# Altium project RK_MEGAPLATA.PrjPcb (part 5 of 9)

## Sheet PORT_TYPE_C.SchDoc
size 420 x 297 mm; SheetNumber: 15; SheetTotal: 23
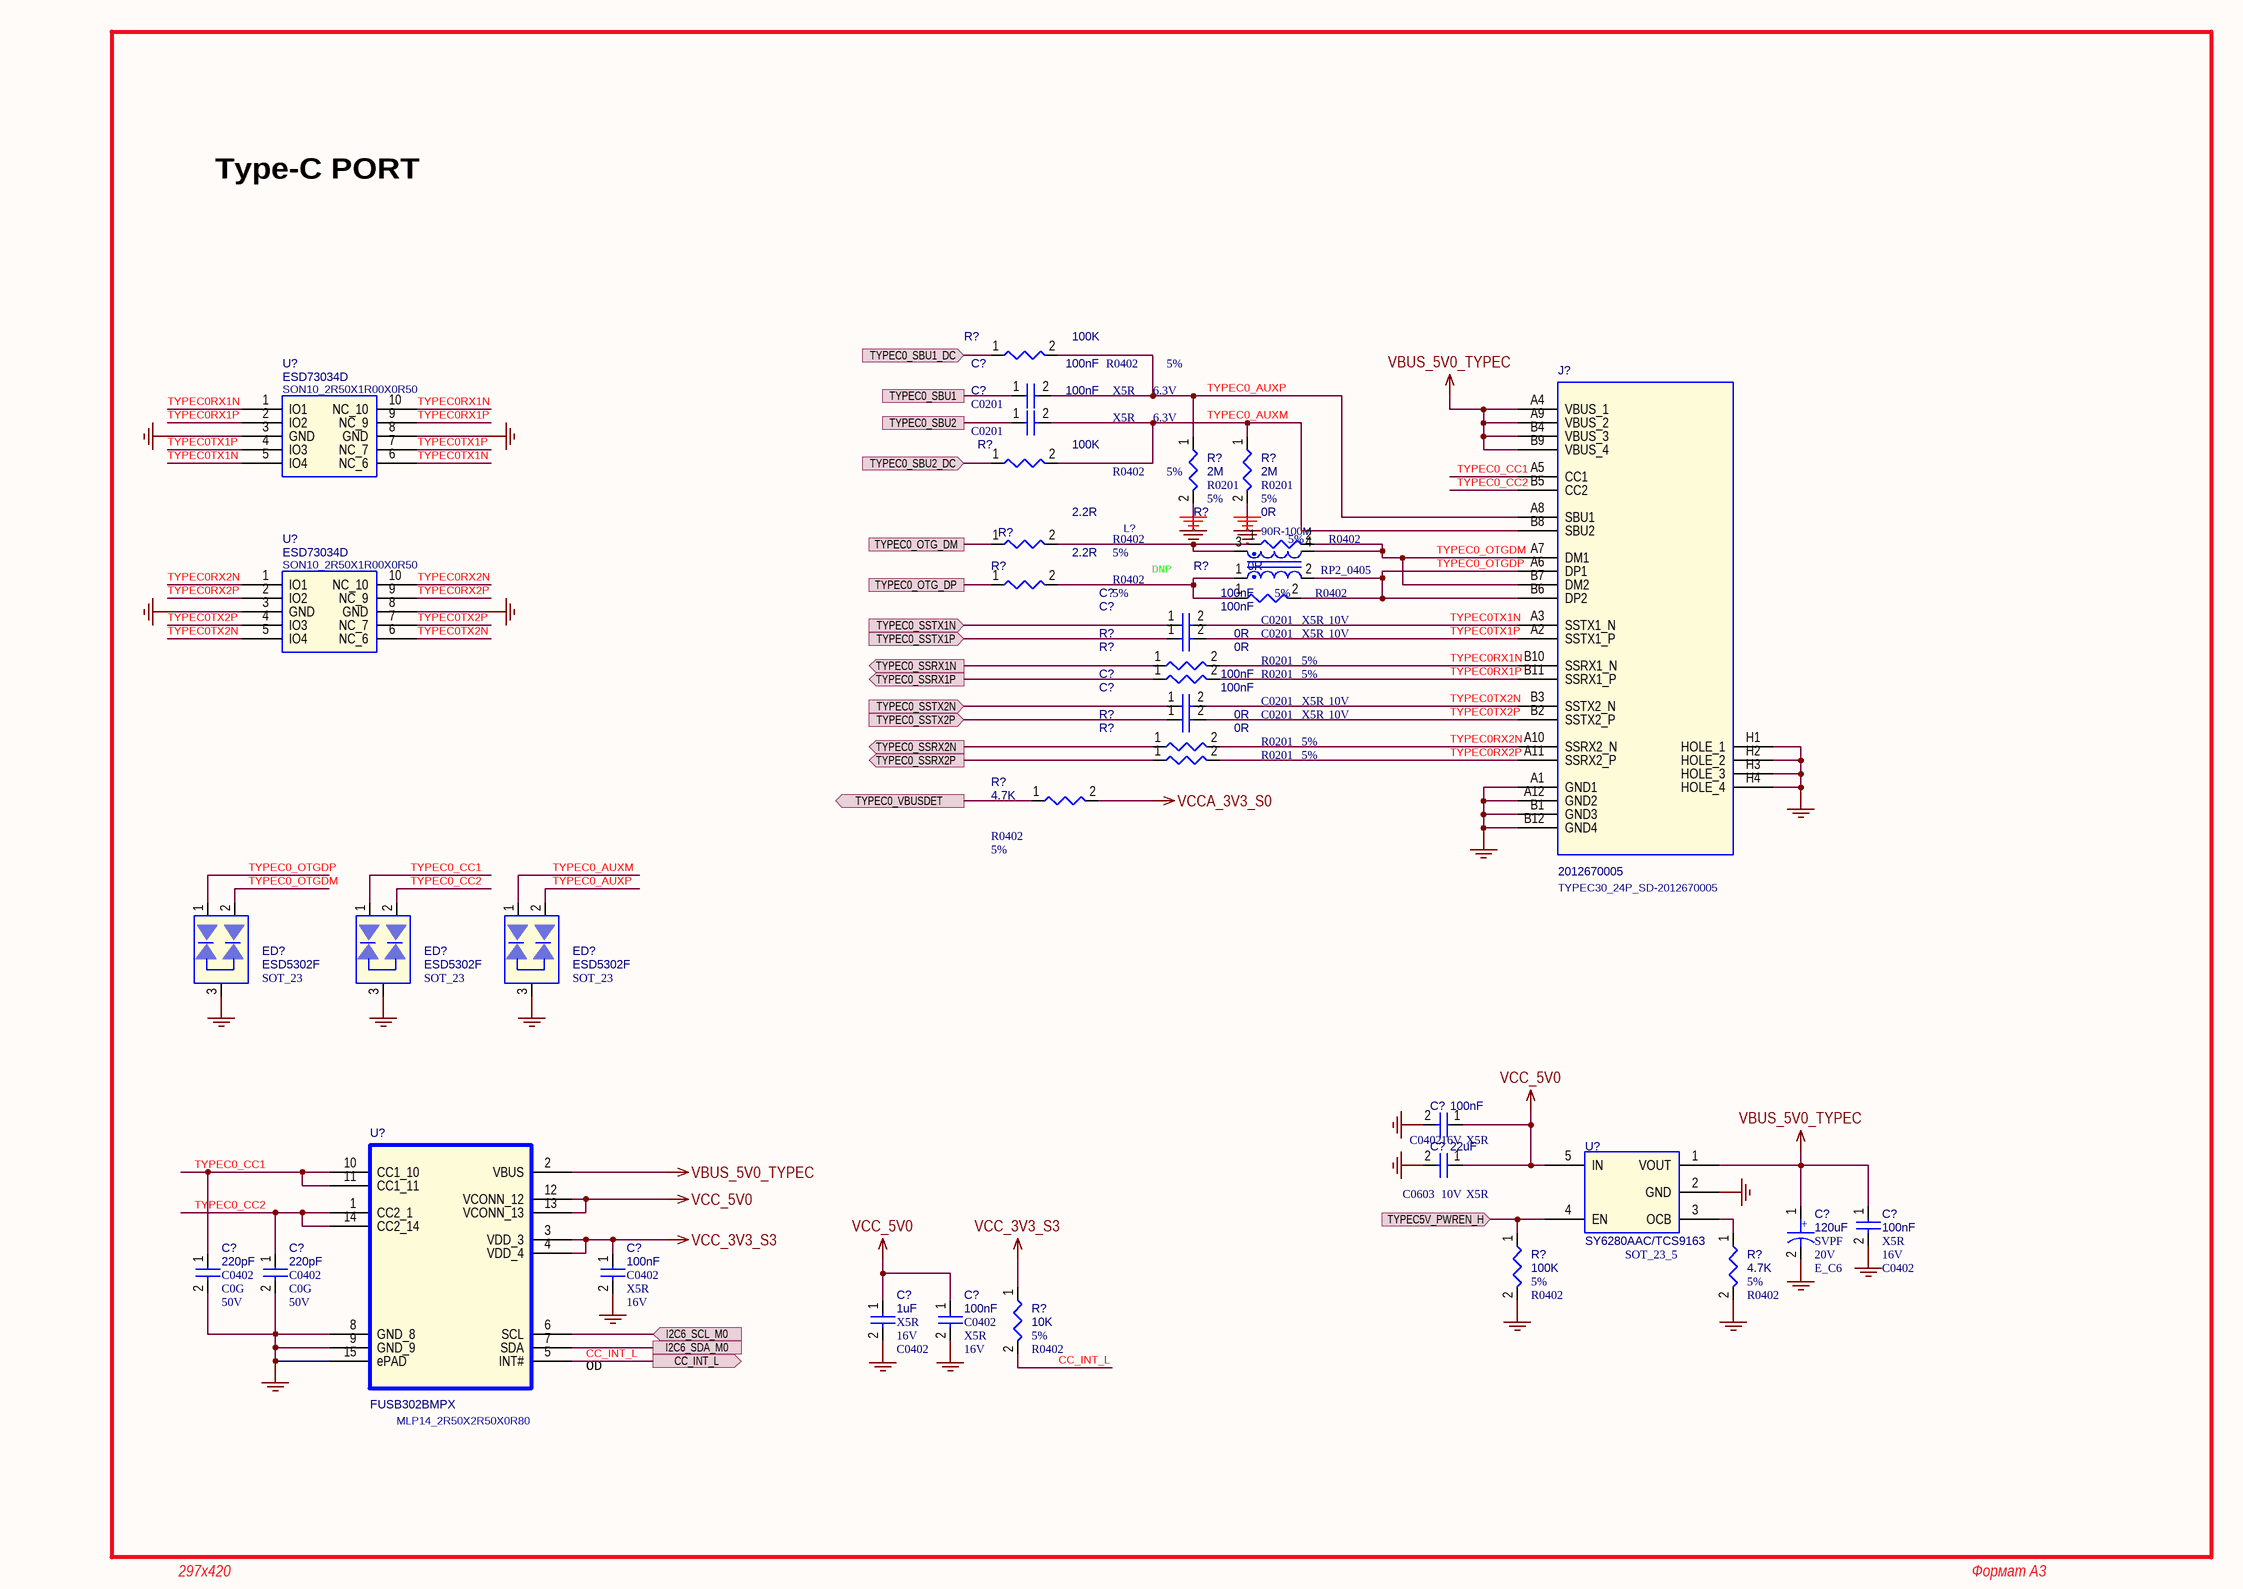
[diagram p17: PORT_TYPE_C.SchDoc]

### Parts
(Parts that share a designator on the sheet are numbered #1, #2 ... from top to bottom, then left to right.)
C?#185  100nF  Dielectric: X5R  Voltage: 6.3V  [C0201]
C?#186  100nF  Dielectric: X5R  Voltage: 6.3V  [C0201]
C?#187  100nF  Dielectric: X5R  Voltage: 10V  [C0201]
C?#188  100nF  Dielectric: X5R  Voltage: 10V  [C0201]
C?#189  100nF  Dielectric: X5R  Voltage: 10V  [C0201]
C?#190  100nF  Dielectric: X5R  Voltage: 10V  [C0201]
C?#191  100nF  Dielectric: X5R  Voltage: 16V  [C0402]
C?#192  22uF  Dielectric: X5R  Voltage: 10V  [C0603]
C?#193  120uF  Voltage: 20V  Dielectric: SVPF  [E_C6]
C?#194  100nF  Dielectric: X5R  Voltage: 16V  [C0402]
C?#195  220pF  Dielectric: C0G  Voltage: 50V  [C0402]
C?#196  220pF  Dielectric: C0G  Voltage: 50V  [C0402]
C?#197  100nF  Dielectric: X5R  Voltage: 16V  [C0402]
C?#198  1uF  Dielectric: X5R  Voltage: 16V  [C0402]
C?#199  100nF  Dielectric: X5R  Voltage: 16V  [C0402]
ED?#4  ESD5302F  [SOT_23]
ED?#5  ESD5302F  [SOT_23]
ED?#6  ESD5302F  [SOT_23]
J?#3  2012670005  [TYPEC30_24P_SD-2012670005]
L?#15  90R-100M  PCB Footprint: RP2_0405  OPTION: DNP  [L0402D]
R?#69  100K  Tolerance: 5%  [R0402]
R?#70  2M  Tolerance: 5%  PCB Footprint: R0201  [R0402]
R?#71  2M  Tolerance: 5%  PCB Footprint: R0201  [R0402]
R?#72  100K  Tolerance: 5%  [R0402]
R?#73  2.2R  Tolerance: 5%  [R0402]
R?#74  0R  Tolerance: 5%  [R0402]
R?#75  2.2R  Tolerance: 5%  [R0402]
R?#76  0R  Tolerance: 5%  [R0402]
R?#77  0R  Tolerance: 5%  PCB Footprint: R0201  [R0402]
R?#78  0R  Tolerance: 5%  PCB Footprint: R0201  [R0402]
R?#79  0R  Tolerance: 5%  PCB Footprint: R0201  [R0402]
R?#80  0R  Tolerance: 5%  PCB Footprint: R0201  [R0402]
R?#81  4.7K  Tolerance: 5%  [R0402]
R?#82  100K  Tolerance: 5%  [R0402]
R?#83  4.7K  Tolerance: 5%  [R0402]
R?#84  10K  Tolerance: 5%  [R0402]
U?#30  ESD73034D  [SON10_2R50X1R00X0R50]
U?#31  ESD73034D  [SON10_2R50X1R00X0R50]
U?#32  FUSB302BMPX  [MLP14_2R50X2R50X0R80]
U?#33  SY6280AAC/TCS9163  [SOT_23_5]

### Ports
CC_INT_L (out, see RK3588_OSC_PLL[3C]), I2C6_SCL_M0 (in, see RK3588_OSC_PLL[3C]), I2C6_SDA_M0 (see RK3588_OSC_PLL[3C]), TYPEC0_OTG_DM (see RK3588_TYPE_C[3B]), TYPEC0_OTG_DP (see RK3588_TYPE_C[3B]), TYPEC0_SBU1 (see RK3588_TYPE_C[2B]), TYPEC0_SBU1_DC (in, see RK3588_GPIO_MAYBE_IMPORTANT_PINS[4A]), TYPEC0_SBU2 (see RK3588_TYPE_C[2B]), TYPEC0_SBU2_DC (in, see RK3588_GPIO_MAYBE_IMPORTANT_PINS[4A]), TYPEC0_SSRX1N (out, see RK3588_TYPE_C[2B]), TYPEC0_SSRX1P (out, see RK3588_TYPE_C[2B]), TYPEC0_SSRX2N (out, see RK3588_TYPE_C[2B]), TYPEC0_SSRX2P (out, see RK3588_TYPE_C[2B]), TYPEC0_SSTX1N (in, see RK3588_TYPE_C[2B]), TYPEC0_SSTX1P (in, see RK3588_TYPE_C[2B]), TYPEC0_SSTX2N (in, see RK3588_TYPE_C[2B]), TYPEC0_SSTX2P (in, see RK3588_TYPE_C[2B]), TYPEC0_VBUSDET (out, see RK3588_TYPE_C[3B]), TYPEC5V_PWREN_H (in, see RK3588_GPIO_MAYBE_IMPORTANT_PINS[4A])

### Nets
GND: C?#191.2 C?#192.2 C?#193.2 C?#194.2 C?#195.2 C?#196.2 C?#197.2 C?#198.2 C?#199.2 ED?#4.3 ED?#5.3 ED?#6.3 J?#3.A1(GND1) J?#3.A12(GND2) J?#3.B1(GND3) J?#3.B12(GND4) J?#3.H1(HOLE_1) J?#3.H2(HOLE_2) J?#3.H3(HOLE_3) J?#3.H4(HOLE_4) R?#70.2 R?#71.2 R?#82.2 R?#83.2 U?#30.3(GND) U?#30.8(GND) U?#31.3(GND) U?#31.8(GND) U?#32.8(GND_8) U?#32.9(GND_9) U?#32.15(ePAD) U?#33.2(GND)
VBUS_5V0_TYPEC: C?#193.1 C?#194.1 J?#3.A4(VBUS_1) J?#3.A9(VBUS_2) J?#3.B4(VBUS_3) J?#3.B9(VBUS_4) U?#32.2(VBUS) U?#33.1(VOUT)
VCC_3V3_S3: C?#197.1 R?#84.1 U?#32.3(VDD_3) U?#32.4(VDD_4)
VCC_5V0: C?#191.1 C?#192.1 C?#198.1 C?#199.1 U?#32.12(VCONN_12) U?#32.13(VCONN_13) U?#33.5(IN)
VCCA_3V3_S0: R?#81.2
CC_INT_L: R?#84.2 U?#32.5(INT#) ; port CC_INT_L
I2C6_SCL_M0: U?#32.6(SCL) ; port I2C6_SCL_M0
I2C6_SDA_M0: U?#32.7(SDA) ; port I2C6_SDA_M0
TYPEC0_AUXM: C?#186.2 ED?#6.1 J?#3.B8(SBU2) R?#71.1 R?#72.2
TYPEC0_AUXP: C?#185.2 ED?#6.2 J?#3.A8(SBU1) R?#69.2 R?#70.1
TYPEC0_CC1: C?#195.1 ED?#5.1 J?#3.A5(CC1) U?#32.10(CC1_10) U?#32.11(CC1_11)
TYPEC0_CC2: C?#196.1 ED?#5.2 J?#3.B5(CC2) U?#32.1(CC2_1) U?#32.14(CC2_14)
TYPEC0_OTGDM: ED?#4.2 J?#3.A7(DM1) J?#3.B7(DM2) L?#15.4 R?#74.2
TYPEC0_OTGDP: ED?#4.1 J?#3.A6(DP1) J?#3.B6(DP2) L?#15.2 R?#76.2
TYPEC0RX1N: J?#3.B10(SSRX1_N) R?#77.2 U?#30.1(IO1) U?#30.10(NC_10)
TYPEC0RX1P: J?#3.B11(SSRX1_P) R?#78.2 U?#30.2(IO2) U?#30.9(NC_9)
TYPEC0RX2N: J?#3.A10(SSRX2_N) R?#79.2 U?#31.1(IO1) U?#31.10(NC_10)
TYPEC0RX2P: J?#3.A11(SSRX2_P) R?#80.2 U?#31.2(IO2) U?#31.9(NC_9)
TYPEC0TX1N: C?#187.2 J?#3.A3(SSTX1_N) U?#30.5(IO4) U?#30.6(NC_6)
TYPEC0TX1P: C?#188.2 J?#3.A2(SSTX1_P) U?#30.4(IO3) U?#30.7(NC_7)
TYPEC0TX2N: C?#189.2 J?#3.B3(SSTX2_N) U?#31.5(IO4) U?#31.6(NC_6)
TYPEC0TX2P: C?#190.2 J?#3.B2(SSTX2_P) U?#31.4(IO3) U?#31.7(NC_7)
NetC?#185_1: C?#185.1 ; port TYPEC0_SBU1
NetC?#186_1: C?#186.1 ; port TYPEC0_SBU2
NetC?#187_1: C?#187.1 ; port TYPEC0_SSTX1N
NetC?#188_1: C?#188.1 ; port TYPEC0_SSTX1P
NetC?#189_1: C?#189.1 ; port TYPEC0_SSTX2N
NetC?#190_1: C?#190.1 ; port TYPEC0_SSTX2P
NetL?#15_1: L?#15.1 R?#75.2 R?#76.1
NetL?#15_3: L?#15.3 R?#73.2 R?#74.1
NetR?#69_1: R?#69.1 ; port TYPEC0_SBU1_DC
NetR?#72_1: R?#72.1 ; port TYPEC0_SBU2_DC
NetR?#73_1: R?#73.1 ; port TYPEC0_OTG_DM
NetR?#75_1: R?#75.1 ; port TYPEC0_OTG_DP
NetR?#77_1: R?#77.1 ; port TYPEC0_SSRX1N
NetR?#78_1: R?#78.1 ; port TYPEC0_SSRX1P
NetR?#79_1: R?#79.1 ; port TYPEC0_SSRX2N
NetR?#80_1: R?#80.1 ; port TYPEC0_SSRX2P
NetR?#81_1: R?#81.1 ; port TYPEC0_VBUSDET
NetR?#82_1: R?#82.1 U?#33.4(EN) ; port TYPEC5V_PWREN_H
NetR?#83_1: R?#83.1 U?#33.3(OCB)

### Notes on the sheet
- Type-C PORT
- OD
- 297x420
- Формат А3
- (in symbol CAP) +

### Library data of the parts
C?#185 = CAP NP_Dup1: cap,100.00nF,+/-10%,6.3V,X5R,C0201; Part Reference: C2600; Manufacturer: TDK; RK PN: C0603X5R0J104K030BC; Priority: A; Tolerance: 10%; PCB Footprint: C0201; Value: 100nF; Part Type: C0201; Manufacturer PN: C0603X5R0J104K030BC; Created by: JJJ
C?#186 = CAP NP_Dup1: cap,100.00nF,+/-10%,6.3V,X5R,C0201; Part Reference: C2601; Manufacturer PN: C0603X5R0J104K030BC; Manufacturer: TDK; Tolerance: 10%; Priority: A; PCB Footprint: C0201; Value: 100nF; Created by: JJJ; Part Type: C0201; RK PN: C0603X5R0J104K030BC
C?#187 = CAP NP_Dup1: cap,100.00nF,+/-10%,10V,X5R,C0201; Part Reference: C2602; Manufacturer PN: C0603X5R1A104K030BC; Manufacturer: TDK; Tolerance: 10%; Priority: A; PCB Footprint: C0201; Value: 100nF; Created by: JJJ; Part Type: C0201; RK PN: C0603X5R1A104K030BC
C?#188 = CAP NP_Dup1: cap,100.00nF,+/-10%,10V,X5R,C0201; Part Reference: C2603; Manufacturer: TDK; RK PN: C0603X5R1A104K030BC; Priority: A; Tolerance: 10%; PCB Footprint: C0201; Value: 100nF; Part Type: C0201; Manufacturer PN: C0603X5R1A104K030BC; Created by: JJJ
C?#189 = CAP NP_Dup1: cap,100.00nF,+/-10%,10V,X5R,C0201; Part Reference: C2604; Manufacturer: TDK; RK PN: C0603X5R1A104K030BC; Priority: A; Tolerance: 10%; PCB Footprint: C0201; Value: 100nF; Part Type: C0201; Manufacturer PN: C0603X5R1A104K030BC; Created by: JJJ
C?#190 = CAP NP_Dup1: cap,100.00nF,+/-10%,10V,X5R,C0201; Part Reference: C2605; Manufacturer: TDK; RK PN: C0603X5R1A104K030BC; Priority: A; Tolerance: 10%; PCB Footprint: C0201; Value: 100nF; Part Type: C0201; Manufacturer PN: C0603X5R1A104K030BC; Created by: JJJ
C?#191 = CAP NP_Dup1: cap,100.00nF,+/-10%,16V,X5R,C0402; Part Reference: C2606; Manufacturer: TDK; RK PN: C1005X5R1C104K050BA; Priority: A; C_Voltage: 6.3V; Tolerance: 10%; PCB Footprint: C0402; Value: 100nF; Part Type: C0402; Manufacturer PN: C1005X5R1C104K050BA; Created by: JJJ
C?#192 = CAP NP_Dup1: cap,22.00uF,+/-20%,10V,X5R,C0603; Part Reference: C2607; Manufacturer: TDK; RK PN: C1608X5R1A226M080AC; Priority: A; C_Voltage: 6.3V; Tolerance: 20%; PCB Footprint: C0603; Value: 22uF; Part Type: C0603; Manufacturer PN: C1608X5R1A226M080AC; Created by: JJJ
C?#193 = CAP: 120uF,20V,25mR,SVPF; Part Reference: C2610; Manufacturer: Panasonic; RK PN: 20SVPF120M; Priority: A; Tolerance: 20%; PCB Footprint: E_C6; Value: 120uF; Part Type: МщЖ¬№ММ¬ВБµзЅв; Manufacturer PN: 20SVPF120M; Created by: YWQ
C?#194 = CAP NP_Dup1: cap,100.00nF,+/-10%,16V,X5R,C0402; Part Reference: C2611; Manufacturer: TDK; RK PN: C1005X5R1C104K050BA; Priority: A; Tolerance: 10%; PCB Footprint: C0402; Value: 100nF; Part Type: C0402; Manufacturer PN: C1005X5R1C104K050BA; Created by: JJJ
C?#195 = CAP NP_Dup1: cap,220.00pF,+/-5%,50V,C0G,C0402; Part Reference: C2612; Manufacturer: TDK; RK PN: C1005C0G1H221J050BA; Priority: A; Tolerance: 5%; PCB Footprint: C0402; Value: 220pF; Part Type: C0402; Manufacturer PN: C1005C0G1H221J050BA; Created by: JJJ
C?#196 = CAP NP_Dup1: cap,220.00pF,+/-5%,50V,C0G,C0402; Part Reference: C2613; Manufacturer PN: C1005C0G1H221J050BA; Manufacturer: TDK; Tolerance: 5%; Priority: A; PCB Footprint: C0402; Value: 220pF; Created by: JJJ; Part Type: C0402; RK PN: C1005C0G1H221J050BA
C?#197 = CAP NP_Dup1: cap,100.00nF,+/-10%,16V,X5R,C0402; Part Reference: C2614; Manufacturer PN: C1005X5R1C104K050BA; Manufacturer: TDK; Tolerance: 10%; Priority: A; PCB Footprint: C0402; Value: 100nF; Created by: JJJ; Part Type: C0402; RK PN: C1005X5R1C104K050BA
C?#198 = CAP NP_Dup1: cap,1.00uF,+/-10%,16V,X5R,C0402; Part Reference: C2608; Manufacturer: TDK; RK PN: C1005X5R1C105K050BC; Priority: A; Tolerance: 10%; PCB Footprint: C0402; Value: 1uF; Part Type: C0402; Manufacturer PN: C1005X5R1C105K050BC; Created by: JJJ
C?#199 = CAP NP_Dup1: cap,100.00nF,+/-10%,16V,X5R,C0402; Part Reference: C2609; Manufacturer: TDK; RK PN: C1005X5R1C104K050BA; Priority: A; Tolerance: 10%; PCB Footprint: C0402; Value: 100nF; Part Type: C0402; Manufacturer PN: C1005X5R1C104K050BA; Created by: JJJ
ED?#4 = ESD_ESDA6V8UL: 2-Lines, Uni-directional,Ultra-low Capacitance.Transient Voltage Suppressors; Part Reference: ED2600; Manufacturer: WillSemi(О¤¶ы°лµјМе); Priority: A; PCB Footprint: SOT_23; Value: ESD5302F; Created by: JJJ; Manufacturer PN: ESD5302F; Part Type: ESD_TVS; RK PN: ESD5302F
ED?#5 = ESD_ESDA6V8UL: 2-Lines, Uni-directional,Ultra-low Capacitance.Transient Voltage Suppressors; Part Reference: ED2601; Manufacturer: WillSemi(О¤¶ы°лµјМе); Priority: A; PCB Footprint: SOT_23; Value: ESD5302F; RK PN: ESD5302F; Part Type: ESD_TVS; Manufacturer PN: ESD5302F; Created by: JJJ
ED?#6 = ESD_ESDA6V8UL: 2-Lines, Uni-directional,Ultra-low Capacitance.Transient Voltage Suppressors; Part Reference: ED2602; Manufacturer: WillSemi(О¤¶ы°лµјМе); Priority: A; PCB Footprint: SOT_23; Value: ESD5302F; Created by: JJJ; Manufacturer PN: ESD5302F; Part Type: ESD_TVS; RK PN: ESD5302F
J?#3 = USB31_TYPE_C_24P: USB Type-CОФКЅДёЧщ,МщєёЈ¬USB3.1ЅУїЪ; Part Reference: J2600; Manufacturer: MOLEX; RK PN: SD-105450-001; Priority: A; PCB Footprint: TYPEC30_24P_SD-2012670005; Value: 2012670005; Part Type: USB Jack; Manufacturer Part Number: SD-105450-001; Created by: YWQ
L?#15 = INDUCTOR COM: Multi-layer common mode filter array For high-speed differential signal lines.Differential mode cut-off frequency:MCZ1210AH series : 2.5GHz typ.MCZ1210CH series : 3.5GHz typ.MCZ1210DH series : 4 to 6GHz typ.; Part Reference: L2600; Manufacturer PN: MCZ1210AH900L2T; Manufacturer: EMC; Resonace frequency: 90R@100M; Irms: 200mA; DC Resistor: 1.75ohm; Priority: A; Value: 90R-100M; Created by: JJJ; Part Type: BEAD; RK PN: MCZ1210AH900L2T
R?#69 = RESISTOR_Dup2: НЁУГєсД¤µзЧи,100K,+/-5%,R0402,1/16W.; Part Reference: R2600; Manufacturer PN: RC0402JR-07100KL; Manufacturer: YAGEO; Wattage: 1/16W; Priority: A; PCB Footprint: R0402; Value: 100K; Created by: YTL; Part Type: НЁУГєсД¤µзЧи; RK PN: RC0402JR-07100KL
R?#70 = RESISTOR_Dup2: НЁУГєсД¤µзЧи,2M,+/-5%,R0201,1/20W.; Part Reference: R2601; Manufacturer: YAGEO; RK PN: RC0201JR-072ML; Priority: A; Wattage: 1/20W; Value: 2M; Part Type: НЁУГєсД¤µзЧи; Manufacturer PN: RC0201JR-072ML; Created by: YTL
R?#71 = RESISTOR_Dup2: НЁУГєсД¤µзЧи,2M,+/-5%,R0201,1/20W.; Part Reference: R2602; Manufacturer PN: RC0201JR-072ML; Manufacturer: YAGEO; Wattage: 1/20W; Priority: A; Value: 2M; Created by: YTL; Part Type: НЁУГєсД¤µзЧи; RK PN: RC0201JR-072ML
R?#72 = RESISTOR_Dup2: НЁУГєсД¤µзЧи,100K,+/-5%,R0402,1/16W.; Part Reference: R2603; Manufacturer PN: RC0402JR-07100KL; Manufacturer: YAGEO; Wattage: 1/16W; Priority: A; PCB Footprint: R0402; Value: 100K; Created by: YTL; Part Type: НЁУГєсД¤µзЧи; RK PN: RC0402JR-07100KL
R?#73 = RESISTOR_Dup2: НЁУГєсД¤µзЧи,2R2,+/-5%,R0402,1/16W.; Part Reference: R2630; Manufacturer PN: RC0402JR-072R2L; Manufacturer: YAGEO; Wattage: 1/16W; Priority: A; PCB Footprint: R0402; Value: 2.2R; Created by: YTL; Part Type: НЁУГєсД¤µзЧи; RK PN: RC0402JR-072R2L
R?#74 = RESISTOR_Dup2: НЁУГєсД¤µзЧи,0R,+/-5%,R0402,1/16W.; Part Reference: R2604; Manufacturer PN: RC0402JR-070RL; Manufacturer: YAGEO; Wattage: 1/16W; Priority: A; PCB Footprint: R0402; Value: 0R; Created by: YTL; Part Type: НЁУГєсД¤µзЧи; RK PN: RC0402JR-070RL
R?#75 = RESISTOR_Dup2: НЁУГєсД¤µзЧи,2R2,+/-5%,R0402,1/16W.; Part Reference: R2631; Manufacturer: YAGEO; RK PN: RC0402JR-072R2L; Priority: A; Wattage: 1/16W; PCB Footprint: R0402; Value: 2.2R; Part Type: НЁУГєсД¤µзЧи; Manufacturer PN: RC0402JR-072R2L; Created by: YTL
R?#76 = RESISTOR_Dup2: НЁУГєсД¤µзЧи,0R,+/-5%,R0402,1/16W.; Part Reference: R2605; Manufacturer: YAGEO; RK PN: RC0402JR-070RL; Priority: A; Wattage: 1/16W; PCB Footprint: R0402; Value: 0R; Part Type: НЁУГєсД¤µзЧи; Manufacturer PN: RC0402JR-070RL; Created by: YTL
R?#77 = RESISTOR_Dup2: НЁУГєсД¤µзЧи,0R,+/-5%,R0201,1/20W.; Part Reference: R2606; Manufacturer PN: RC0201JR-070RL; Manufacturer: YAGEO; Wattage: 1/20W; Priority: A; Value: 0R; Created by: YTL; Part Type: НЁУГєсД¤µзЧи; RK PN: RC0201JR-070RL
R?#78 = RESISTOR_Dup2: НЁУГєсД¤µзЧи,0R,+/-5%,R0201,1/20W.; Part Reference: R2607; Manufacturer: YAGEO; RK PN: RC0201JR-070RL; Priority: A; Wattage: 1/20W; Value: 0R; Part Type: НЁУГєсД¤µзЧи; Manufacturer PN: RC0201JR-070RL; Created by: YTL
R?#79 = RESISTOR_Dup2: НЁУГєсД¤µзЧи,0R,+/-5%,R0201,1/20W.; Part Reference: R2608; Manufacturer: YAGEO; RK PN: RC0201JR-070RL; Priority: A; Wattage: 1/20W; Value: 0R; Part Type: НЁУГєсД¤µзЧи; Manufacturer PN: RC0201JR-070RL; Created by: YTL
R?#80 = RESISTOR_Dup2: НЁУГєсД¤µзЧи,0R,+/-5%,R0201,1/20W.; Part Reference: R2609; Manufacturer PN: RC0201JR-070RL; Manufacturer: YAGEO; Wattage: 1/20W; Priority: A; Value: 0R; Created by: YTL; Part Type: НЁУГєсД¤µзЧи; RK PN: RC0201JR-070RL
R?#81 = RESISTOR_Dup2: НЁУГєсД¤µзЧи,4K7,+/-5%,R0402,1/16W.; Part Reference: R2610; Manufacturer: YAGEO; RK PN: RC0402JR-074K7L; Priority: A; Wattage: 1/16W; PCB Footprint: R0402; Value: 4.7K; Part Type: НЁУГєсД¤µзЧи; Manufacturer PN: RC0402JR-074K7L; Created by: YTL
R?#82 = RESISTOR_Dup2: НЁУГєсД¤µзЧи,100K,+/-5%,R0402,1/16W.; Part Reference: R2611; Manufacturer: YAGEO; RK PN: RC0402JR-07100KL; Priority: A; Wattage: 1/16W; PCB Footprint: R0402; Value: 100K; Part Type: НЁУГєсД¤µзЧи; Manufacturer PN: RC0402JR-07100KL; Created by: YTL
R?#83 = RESISTOR_Dup2: НЁУГєсД¤µзЧи,4K7,+/-5%,R0402,1/16W.; Part Reference: R2612; Manufacturer: YAGEO; RK PN: RC0402JR-074K7L; Priority: A; Wattage: 1/16W; PCB Footprint: R0402; Value: 4.7K; Part Type: НЁУГєсД¤µзЧи; Manufacturer PN: RC0402JR-074K7L; Created by: YTL
R?#84 = RESISTOR_Dup2: НЁУГєсД¤µзЧи,10K,+/-5%,R0402,1/16W.; Part Reference: R2613; Manufacturer PN: RC0402JR-0710KL; Manufacturer: YAGEO; Wattage: 1/16W; Priority: A; PCB Footprint: R0402; Value: 10K; Created by: YTL; Part Type: НЁУГєсД¤µзЧи; RK PN: RC0402JR-0710KL
U?#30 = ESD_ESD5304D: 4-Lines, Uni-directional, Ultra-low Capacitance Transient Voltage Suppressors; Part Reference: U2600; Manufacturer: WillSemi(О¤¶ы°лµјМе); Priority: A; PCB Footprint: SON10_2R50X1R00X0R50; Value: ESD73034D; Created by: JJJ; Manufacturer PN: ESD5304D; Part Type: ESD_TVS; RK PN: ESD5304D
U?#31 = ESD_ESD5304D: 4-Lines, Uni-directional, Ultra-low Capacitance Transient Voltage Suppressors; Part Reference: U2601; Manufacturer: WillSemi(О¤¶ы°лµјМе); Priority: A; PCB Footprint: SON10_2R50X1R00X0R50; Value: ESD73034D; RK PN: ESD5304D; Part Type: ESD_TVS; Manufacturer PN: ESD5304D; Created by: JJJ
U?#32 = USB_FUSB302B: Programmable USB Type-C Controller w/PD; Part Reference: U2602; Manufacturer: Fairchild(·ЙХЧ°лµјМе); Priority: A; PCB Footprint: MLP14_2R50X2R50X0R80; Value: FUSB302BMPX; Created by: JJJ; Manufacturer PN: FUSB302BMPX; Part Type: USB; RK PN: FUSB302BMPX
U?#33 = SWITCH_SY6280: Low Loss Power Distribution Switch; Part Reference: U2603; Manufacturer: SilergyЈЁОщБ¦ЅЬЈ©; Priority: A; PCB Footprint: SOT_23_5; Value: SY6280AAC/TCS9163; RK PN: SY6280AAC; Part Type: Switch; Manufacturer PN: SY6280AAC; Created by: JJJ

## Sheet DRAM_LPDDR4X_200P_2X32bit.SchDoc
size 594 x 420 mm; SheetNumber: 16; SheetTotal: 23
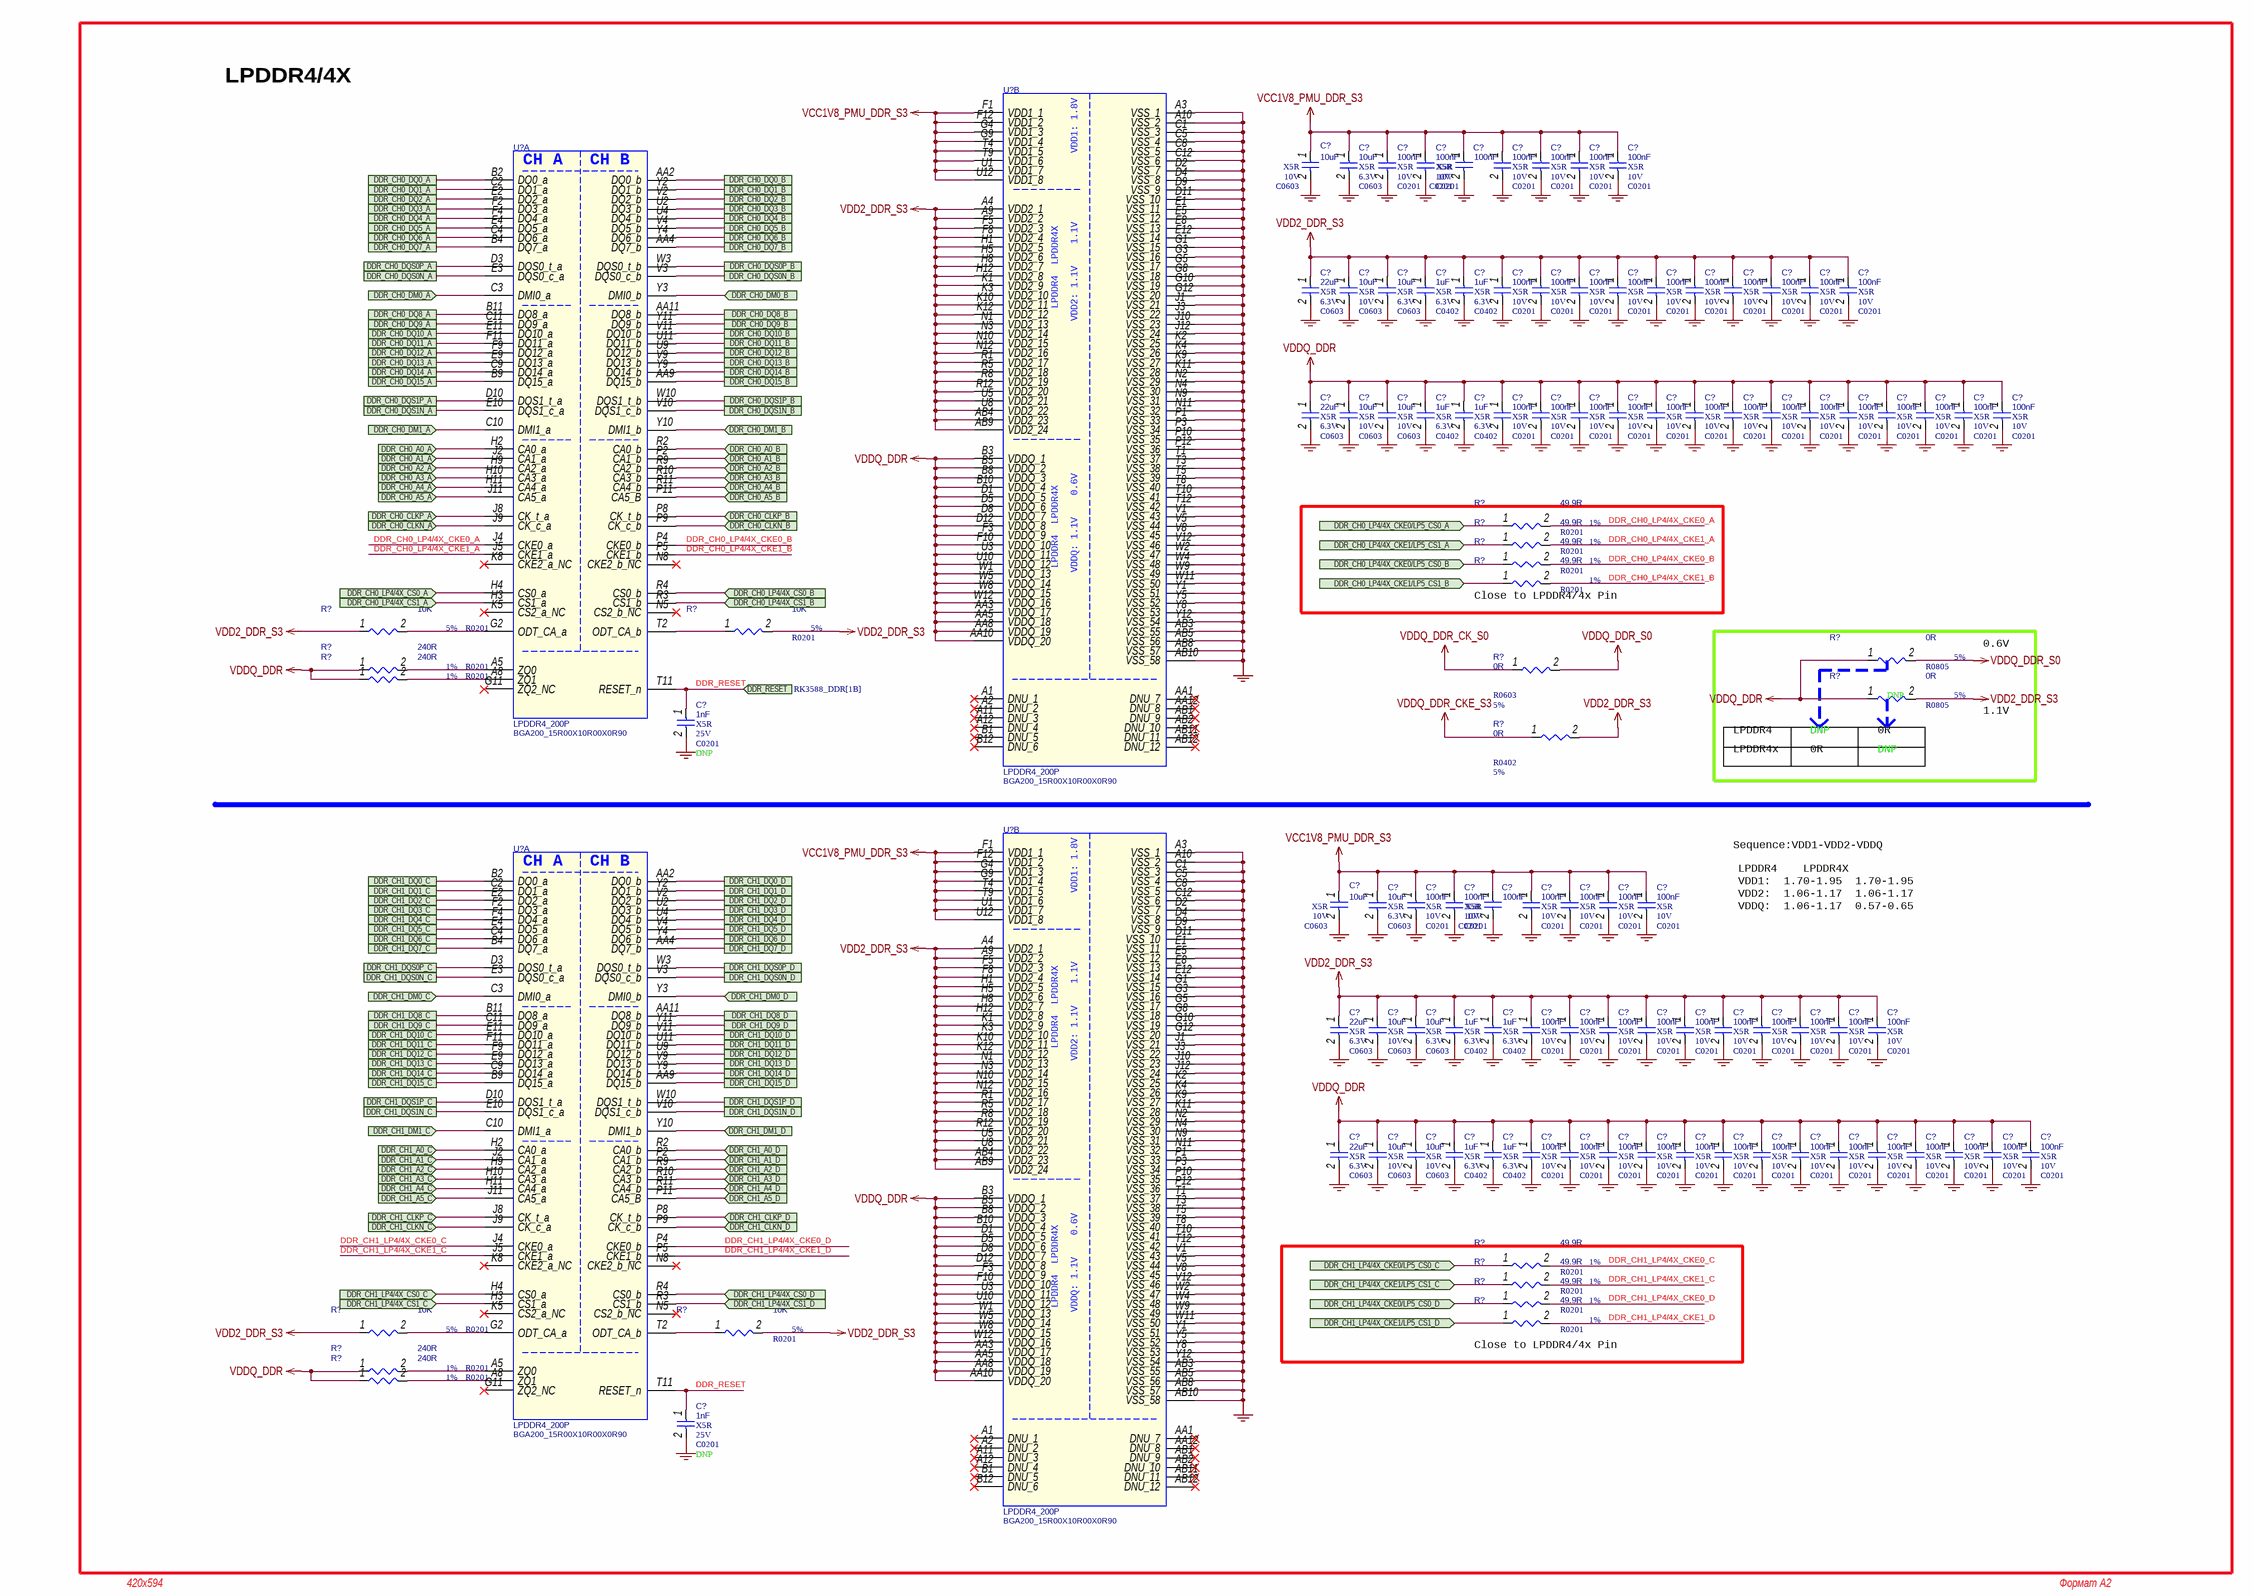
[diagram p18: DRAM_LPDDR4X_200P_2X32bit.SchDoc]

### Parts
(Parts that share a designator on the sheet are numbered #1, #2 ... from top to bottom, then left to right.)
C?#200  10uF  Dielectric: X5R  Voltage: 10V  [C0603]
C?#201  10uF  Dielectric: X5R  Voltage: 6.3V  [C0603]
C?#202  100nF  Dielectric: X5R  Voltage: 10V  [C0201]
C?#203  100nF  Dielectric: X5R  Voltage: 10V  [C0201]
C?#204  100nF  Dielectric: X5R  Voltage: 10V  [C0201]
C?#205  100nF  Dielectric: X5R  Voltage: 10V  [C0201]
C?#206  100nF  Dielectric: X5R  Voltage: 10V  [C0201]
C?#207  100nF  Dielectric: X5R  Voltage: 10V  [C0201]
C?#208  100nF  Dielectric: X5R  Voltage: 10V  [C0201]
C?#209  22uF  Dielectric: X5R  Voltage: 6.3V  [C0603]
C?#210  10uF  Dielectric: X5R  Voltage: 10V  [C0603]
C?#211  10uF  Dielectric: X5R  Voltage: 6.3V  [C0603]
C?#212  1uF  Dielectric: X5R  Voltage: 6.3V  [C0402]
C?#213  1uF  Dielectric: X5R  Voltage: 6.3V  [C0402]
C?#214  100nF  Dielectric: X5R  Voltage: 10V  [C0201]
C?#215  100nF  Dielectric: X5R  Voltage: 10V  [C0201]
C?#216  100nF  Dielectric: X5R  Voltage: 10V  [C0201]
C?#217  100nF  Dielectric: X5R  Voltage: 10V  [C0201]
C?#218  100nF  Dielectric: X5R  Voltage: 10V  [C0201]
C?#219  100nF  Dielectric: X5R  Voltage: 10V  [C0201]
C?#220  100nF  Dielectric: X5R  Voltage: 10V  [C0201]
C?#221  100nF  Dielectric: X5R  Voltage: 10V  [C0201]
C?#222  100nF  Dielectric: X5R  Voltage: 10V  [C0201]
C?#223  100nF  Dielectric: X5R  Voltage: 10V  [C0201]
C?#224  22uF  Dielectric: X5R  Voltage: 6.3V  [C0603]
C?#225  10uF  Dielectric: X5R  Voltage: 10V  [C0603]
C?#226  10uF  Dielectric: X5R  Voltage: 10V  [C0603]
C?#227  1uF  Dielectric: X5R  Voltage: 6.3V  [C0402]
C?#228  1uF  Dielectric: X5R  Voltage: 6.3V  [C0402]
C?#229  100nF  Dielectric: X5R  Voltage: 10V  [C0201]
C?#230  100nF  Dielectric: X5R  Voltage: 10V  [C0201]
C?#231  100nF  Dielectric: X5R  Voltage: 10V  [C0201]
C?#232  100nF  Dielectric: X5R  Voltage: 10V  [C0201]
C?#233  100nF  Dielectric: X5R  Voltage: 10V  [C0201]
C?#234  100nF  Dielectric: X5R  Voltage: 10V  [C0201]
C?#235  100nF  Dielectric: X5R  Voltage: 10V  [C0201]
C?#236  100nF  Dielectric: X5R  Voltage: 10V  [C0201]
C?#237  100nF  Dielectric: X5R  Voltage: 10V  [C0201]
C?#238  100nF  Dielectric: X5R  Voltage: 10V  [C0201]
C?#239  100nF  Dielectric: X5R  Voltage: 10V  [C0201]
C?#240  100nF  Dielectric: X5R  Voltage: 10V  [C0201]
C?#241  100nF  Dielectric: X5R  Voltage: 10V  [C0201]
C?#242  100nF  Dielectric: X5R  Voltage: 10V  [C0201]
C?#243  1nF  Dielectric: X5R  Voltage: 25V  OPTION: DNP  [C0201]
C?#244  10uF  Dielectric: X5R  Voltage: 10V  [C0603]
C?#245  10uF  Dielectric: X5R  Voltage: 6.3V  [C0603]
C?#246  100nF  Dielectric: X5R  Voltage: 10V  [C0201]
C?#247  100nF  Dielectric: X5R  Voltage: 10V  [C0201]
C?#248  100nF  Dielectric: X5R  Voltage: 10V  [C0201]
C?#249  100nF  Dielectric: X5R  Voltage: 10V  [C0201]
C?#250  100nF  Dielectric: X5R  Voltage: 10V  [C0201]
C?#251  100nF  Dielectric: X5R  Voltage: 10V  [C0201]
C?#252  100nF  Dielectric: X5R  Voltage: 10V  [C0201]
C?#253  22uF  Dielectric: X5R  Voltage: 6.3V  [C0603]
C?#254  10uF  Dielectric: X5R  Voltage: 10V  [C0603]
C?#255  10uF  Dielectric: X5R  Voltage: 6.3V  [C0603]
C?#256  1uF  Dielectric: X5R  Voltage: 6.3V  [C0402]
C?#257  1uF  Dielectric: X5R  Voltage: 6.3V  [C0402]
C?#258  100nF  Dielectric: X5R  Voltage: 10V  [C0201]
C?#259  100nF  Dielectric: X5R  Voltage: 10V  [C0201]
C?#260  100nF  Dielectric: X5R  Voltage: 10V  [C0201]
C?#261  100nF  Dielectric: X5R  Voltage: 10V  [C0201]
C?#262  100nF  Dielectric: X5R  Voltage: 10V  [C0201]
C?#263  100nF  Dielectric: X5R  Voltage: 10V  [C0201]
C?#264  100nF  Dielectric: X5R  Voltage: 10V  [C0201]
C?#265  100nF  Dielectric: X5R  Voltage: 10V  [C0201]
C?#266  100nF  Dielectric: X5R  Voltage: 10V  [C0201]
C?#267  100nF  Dielectric: X5R  Voltage: 10V  [C0201]
C?#268  22uF  Dielectric: X5R  Voltage: 6.3V  [C0603]
C?#269  10uF  Dielectric: X5R  Voltage: 10V  [C0603]
C?#270  10uF  Dielectric: X5R  Voltage: 10V  [C0603]
C?#271  1uF  Dielectric: X5R  Voltage: 6.3V  [C0402]
C?#272  1uF  Dielectric: X5R  Voltage: 6.3V  [C0402]
C?#273  100nF  Dielectric: X5R  Voltage: 10V  [C0201]
C?#274  100nF  Dielectric: X5R  Voltage: 10V  [C0201]
C?#275  100nF  Dielectric: X5R  Voltage: 10V  [C0201]
C?#276  100nF  Dielectric: X5R  Voltage: 10V  [C0201]
C?#277  100nF  Dielectric: X5R  Voltage: 10V  [C0201]
C?#278  100nF  Dielectric: X5R  Voltage: 10V  [C0201]
C?#279  100nF  Dielectric: X5R  Voltage: 10V  [C0201]
C?#280  100nF  Dielectric: X5R  Voltage: 10V  [C0201]
C?#281  100nF  Dielectric: X5R  Voltage: 10V  [C0201]
C?#282  100nF  Dielectric: X5R  Voltage: 10V  [C0201]
C?#283  100nF  Dielectric: X5R  Voltage: 10V  [C0201]
C?#284  100nF  Dielectric: X5R  Voltage: 10V  [C0201]
C?#285  100nF  Dielectric: X5R  Voltage: 10V  [C0201]
C?#286  100nF  Dielectric: X5R  Voltage: 10V  [C0201]
C?#287  1nF  Dielectric: X5R  Voltage: 25V  OPTION: DNP  [C0201]
R?#85  49.9R  Tolerance: 1%  PCB Footprint: R0201  [R0402]
R?#86  49.9R  Tolerance: 1%  PCB Footprint: R0201  [R0402]
R?#87  49.9R  Tolerance: 1%  PCB Footprint: R0201  [R0402]
R?#88  49.9R  Tolerance: 1%  PCB Footprint: R0201  [R0402]
R?#89  10K  Tolerance: 5%  PCB Footprint: R0201  [R0402]
R?#90  10K  Tolerance: 5%  PCB Footprint: R0201  [R0402]
R?#91  0R  Tolerance: 5%  PCB Footprint: R0805  [R0402]
R?#92  240R  Tolerance: 1%  PCB Footprint: R0201  [R0402]
R?#93  0R  Tolerance: 5%  PCB Footprint: R0603  [R0402]
R?#94  240R  Tolerance: 1%  PCB Footprint: R0201  [R0402]
R?#95  0R  Tolerance: 5%  PCB Footprint: R0805  OPTION: DNP  [R0402]
R?#96  0R  Tolerance: 5%  [R0402]
R?#97  49.9R  Tolerance: 1%  PCB Footprint: R0201  [R0402]
R?#98  49.9R  Tolerance: 1%  PCB Footprint: R0201  [R0402]
R?#99  49.9R  Tolerance: 1%  PCB Footprint: R0201  [R0402]
R?#100  49.9R  Tolerance: 1%  PCB Footprint: R0201  [R0402]
R?#101  10K  Tolerance: 5%  PCB Footprint: R0201  [R0402]
R?#102  10K  Tolerance: 5%  PCB Footprint: R0201  [R0402]
R?#103  240R  Tolerance: 1%  PCB Footprint: R0201  [R0402]
R?#104  240R  Tolerance: 1%  PCB Footprint: R0201  [R0402]
U?#34  LPDDR4_200P  [BGA200_15R00X10R00X0R90]  (part B of 2)
U?#35  LPDDR4_200P  [BGA200_15R00X10R00X0R90]  (part A of 2)
U?#36  LPDDR4_200P  [BGA200_15R00X10R00X0R90]  (part B of 2)
U?#37  LPDDR4_200P  [BGA200_15R00X10R00X0R90]  (part A of 2)

### Blocks framed on the sheet
Close to LPDDR4/4x Pin: R?#85-R?#88
Close to LPDDR4/4x Pin: R?#97-R?#100

### Ports
DDR_CH0_A0_A (in, see RK3588_DDR[1B]), DDR_CH0_A0_B (in, see RK3588_DDR[2B]), DDR_CH0_A1_A (in, see RK3588_DDR[1B]), DDR_CH0_A1_B (in, see RK3588_DDR[2B]), DDR_CH0_A2_A (in, see RK3588_DDR[1B]), DDR_CH0_A2_B (in, see RK3588_DDR[2B]), DDR_CH0_A3_A (in, see RK3588_DDR[1B]), DDR_CH0_A3_B (in, see RK3588_DDR[2B]), DDR_CH0_A4_A (in, see RK3588_DDR[1B]), DDR_CH0_A4_B (in, see RK3588_DDR[2B]), DDR_CH0_A5_A (in, see RK3588_DDR[1B]), DDR_CH0_A5_B (in, see RK3588_DDR[2B]), DDR_CH0_CLKN_A (in, see RK3588_DDR[1B]), DDR_CH0_CLKN_B (in, see RK3588_DDR[2B]), DDR_CH0_CLKP_A (in, see RK3588_DDR[1B]), DDR_CH0_CLKP_B (in, see RK3588_DDR[2B]), DDR_CH0_DM0_A (in, see RK3588_DDR[1B]), DDR_CH0_DM0_B (in, see RK3588_DDR[2B]), DDR_CH0_DM1_A (in, see RK3588_DDR[1B]), DDR_CH0_DM1_B (in, see RK3588_DDR[2B]), DDR_CH0_DQ0_A (see RK3588_DDR[1A]), DDR_CH0_DQ0_B (see RK3588_DDR[2A]), DDR_CH0_DQ1_A (see RK3588_DDR[1A]), DDR_CH0_DQ1_B (see RK3588_DDR[2A]), DDR_CH0_DQ2_A (see RK3588_DDR[1A]), DDR_CH0_DQ2_B (see RK3588_DDR[2A]), DDR_CH0_DQ3_A (see RK3588_DDR[1A]), DDR_CH0_DQ3_B (see RK3588_DDR[2A]), DDR_CH0_DQ4_A (see RK3588_DDR[1A]), DDR_CH0_DQ4_B (see RK3588_DDR[2A]), DDR_CH0_DQ5_A (see RK3588_DDR[1A]), DDR_CH0_DQ5_B (see RK3588_DDR[2A]), DDR_CH0_DQ6_A (see RK3588_DDR[1A]), DDR_CH0_DQ6_B (see RK3588_DDR[2A]), DDR_CH0_DQ7_A (see RK3588_DDR[1A]), DDR_CH0_DQ7_B (see RK3588_DDR[2A]), DDR_CH0_DQ8_A (see RK3588_DDR[1A]), DDR_CH0_DQ8_B (see RK3588_DDR[2A]), DDR_CH0_DQ9_A (see RK3588_DDR[1A]), DDR_CH0_DQ9_B (see RK3588_DDR[2A]), DDR_CH0_DQ10_A (see RK3588_DDR[1A]), DDR_CH0_DQ10_B (see RK3588_DDR[2A]), DDR_CH0_DQ11_A (see RK3588_DDR[1A]), DDR_CH0_DQ11_B (see RK3588_DDR[2A]), DDR_CH0_DQ12_A (see RK3588_DDR[1B]), DDR_CH0_DQ12_B (see RK3588_DDR[2B]), DDR_CH0_DQ13_A (see RK3588_DDR[1B]), DDR_CH0_DQ13_B (see RK3588_DDR[2B]), DDR_CH0_DQ14_A (see RK3588_DDR[1B]), DDR_CH0_DQ14_B (see RK3588_DDR[2B]), DDR_CH0_DQ15_A (see RK3588_DDR[1B]), DDR_CH0_DQ15_B (see RK3588_DDR[2B]), DDR_CH0_DQS0N_A (see RK3588_DDR[1B]), DDR_CH0_DQS0N_B (see RK3588_DDR[2B]), DDR_CH0_DQS0P_A (see RK3588_DDR[1B]), DDR_CH0_DQS0P_B (see RK3588_DDR[2B]), DDR_CH0_DQS1N_A (see RK3588_DDR[1B]), DDR_CH0_DQS1N_B (see RK3588_DDR[2B]), DDR_CH0_DQS1P_A (see RK3588_DDR[1B]), DDR_CH0_DQS1P_B (see RK3588_DDR[2B]), DDR_CH0_LP4/4X_CKE0/LP5_CS0_A (in, see RK3588_DDR[1B]), DDR_CH0_LP4/4X_CKE0/LP5_CS0_B (in, see RK3588_DDR[2B]), DDR_CH0_LP4/4X_CKE1/LP5_CS1_A (in, see RK3588_DDR[1B]), DDR_CH0_LP4/4X_CKE1/LP5_CS1_B (in, see RK3588_DDR[2B]), DDR_CH0_LP4/4X_CS0_A (in, see RK3588_DDR[1B]), DDR_CH0_LP4/4X_CS0_B (in, see RK3588_DDR[2B]), DDR_CH0_LP4/4X_CS1_A (in, see RK3588_DDR[1B]), DDR_CH0_LP4/4X_CS1_B (in, see RK3588_DDR[2B]), DDR_CH1_A0_C (in, see RK3588_DDR[3B]), DDR_CH1_A0_D (in, see RK3588_DDR[4B]), DDR_CH1_A1_C (in, see RK3588_DDR[3B]), DDR_CH1_A1_D (in, see RK3588_DDR[4B]), DDR_CH1_A2_C (in, see RK3588_DDR[3B]), DDR_CH1_A2_D (in, see RK3588_DDR[4B]), DDR_CH1_A3_C (in, see RK3588_DDR[3B]), DDR_CH1_A3_D (in, see RK3588_DDR[4B]), DDR_CH1_A4_C (in, see RK3588_DDR[3B]), DDR_CH1_A4_D (in, see RK3588_DDR[4B]), DDR_CH1_A5_C (in, see RK3588_DDR[3B]), DDR_CH1_A5_D (in, see RK3588_DDR[4B]), DDR_CH1_CLKN_C (in, see RK3588_DDR[3B]), DDR_CH1_CLKN_D (in, see RK3588_DDR[4B]), DDR_CH1_CLKP_C (in, see RK3588_DDR[3B]), DDR_CH1_CLKP_D (in, see RK3588_DDR[4B]), DDR_CH1_DM0_C (in, see RK3588_DDR[3B]), DDR_CH1_DM0_D (in, see RK3588_DDR[4B]), DDR_CH1_DM1_C (in, see RK3588_DDR[3B]), DDR_CH1_DM1_D (in, see RK3588_DDR[4B]), DDR_CH1_DQ0_C (see RK3588_DDR[3A]), DDR_CH1_DQ0_D (see RK3588_DDR[4A]), DDR_CH1_DQ1_C (see RK3588_DDR[3A]), DDR_CH1_DQ1_D (see RK3588_DDR[4A]), DDR_CH1_DQ2_C (see RK3588_DDR[3A]), DDR_CH1_DQ2_D (see RK3588_DDR[4A]), DDR_CH1_DQ3_C (see RK3588_DDR[3A]), DDR_CH1_DQ3_D (see RK3588_DDR[4A]), DDR_CH1_DQ4_C (see RK3588_DDR[3A]), DDR_CH1_DQ4_D (see RK3588_DDR[4A]), DDR_CH1_DQ5_C (see RK3588_DDR[3A]), DDR_CH1_DQ5_D (see RK3588_DDR[4A]), DDR_CH1_DQ6_C (see RK3588_DDR[3A]), DDR_CH1_DQ6_D (see RK3588_DDR[4A]), DDR_CH1_DQ7_C (see RK3588_DDR[3A]), DDR_CH1_DQ7_D (see RK3588_DDR[4A]), DDR_CH1_DQ8_C (see RK3588_DDR[3A]), DDR_CH1_DQ8_D (see RK3588_DDR[4A]), DDR_CH1_DQ9_C (see RK3588_DDR[3A]), DDR_CH1_DQ9_D (see RK3588_DDR[4A]), DDR_CH1_DQ10_C (see RK3588_DDR[3A]), DDR_CH1_DQ10_D (see RK3588_DDR[4A]), DDR_CH1_DQ11_C (see RK3588_DDR[3A]), DDR_CH1_DQ11_D (see RK3588_DDR[4A]), DDR_CH1_DQ12_C (see RK3588_DDR[3B]), DDR_CH1_DQ12_D (see RK3588_DDR[4B]), DDR_CH1_DQ13_C (see RK3588_DDR[3B]), DDR_CH1_DQ13_D (see RK3588_DDR[4B]), DDR_CH1_DQ14_C (see RK3588_DDR[3B]), DDR_CH1_DQ14_D (see RK3588_DDR[4B]), DDR_CH1_DQ15_C (see RK3588_DDR[3B]), DDR_CH1_DQ15_D (see RK3588_DDR[4B]), DDR_CH1_DQS0N_C (see RK3588_DDR[3B]), DDR_CH1_DQS0N_D (see RK3588_DDR[4B]), DDR_CH1_DQS0P_C (see RK3588_DDR[3B]), DDR_CH1_DQS0P_D (see RK3588_DDR[4B]), DDR_CH1_DQS1N_C (see RK3588_DDR[3B]), DDR_CH1_DQS1N_D (see RK3588_DDR[4B]), DDR_CH1_DQS1P_C (see RK3588_DDR[3B]), DDR_CH1_DQS1P_D (see RK3588_DDR[4B]), DDR_CH1_LP4/4X_CKE0/LP5_CS0_C (in, see RK3588_DDR[3B]), DDR_CH1_LP4/4X_CKE0/LP5_CS0_D (in, see RK3588_DDR[4B]), DDR_CH1_LP4/4X_CKE1/LP5_CS1_C (in, see RK3588_DDR[3B]), DDR_CH1_LP4/4X_CKE1/LP5_CS1_D (in, see RK3588_DDR[4B]), DDR_CH1_LP4/4X_CS0_C (in, see RK3588_DDR[3B]), DDR_CH1_LP4/4X_CS0_D (in, see RK3588_DDR[4B]), DDR_CH1_LP4/4X_CS1_C (in, see RK3588_DDR[3B]), DDR_CH1_LP4/4X_CS1_D (in, see RK3588_DDR[4B]), DDR_RESET (in, see RK3588_DDR[1B])

### Nets
GND: C?#200.2 C?#201.2 C?#202.2 C?#203.2 C?#204.2 C?#205.2 C?#206.2 C?#207.2 C?#208.2 C?#209.2 C?#210.2 C?#211.2 C?#212.2 C?#213.2 C?#214.2 C?#215.2 C?#216.2 C?#217.2 C?#218.2 C?#219.2 C?#220.2 C?#221.2 C?#222.2 C?#223.2 C?#224.2 C?#225.2 C?#226.2 C?#227.2 C?#228.2 C?#229.2 C?#230.2 C?#231.2 C?#232.2 C?#233.2 C?#234.2 C?#235.2 C?#236.2 C?#237.2 C?#238.2 C?#239.2 C?#240.2 C?#241.2 C?#242.2 C?#243.2 C?#244.2 C?#245.2 C?#246.2 C?#247.2 C?#248.2 C?#249.2 C?#250.2 C?#251.2 C?#252.2 C?#253.2 C?#254.2 C?#255.2 C?#256.2 C?#257.2 C?#258.2 C?#259.2 C?#260.2 C?#261.2 C?#262.2 C?#263.2 C?#264.2 C?#265.2 C?#266.2 C?#267.2 C?#268.2 C?#269.2 C?#270.2 C?#271.2 C?#272.2 C?#273.2 C?#274.2 C?#275.2 C?#276.2 C?#277.2 C?#278.2 C?#279.2 C?#280.2 C?#281.2 C?#282.2 C?#283.2 C?#284.2 C?#285.2 C?#286.2 C?#287.2 U?#34.A3(VSS_1) U?#34.A10(VSS_2) U?#34.AB3(VSS_55) U?#34.AB5(VSS_56) U?#34.AB8(VSS_57) U?#34.AB10(VSS_58) U?#34.C1(VSS_3) U?#34.C5(VSS_4) U?#34.C8(VSS_5) U?#34.C12(VSS_6) U?#34.D2(VSS_7) U?#34.D4(VSS_8) U?#34.D9(VSS_9) U?#34.D11(VSS_10) U?#34.E1(VSS_11) U?#34.E5(VSS_12) U?#34.E8(VSS_13) U?#34.E12(VSS_14) U?#34.G1(VSS_15) U?#34.G3(VSS_16) U?#34.G5(VSS_17) U?#34.G8(VSS_18) U?#34.G10(VSS_19) U?#34.G12(VSS_20) U?#34.J1(VSS_21) U?#34.J3(VSS_22) U?#34.J10(VSS_23) U?#34.J12(VSS_24) U?#34.K2(VSS_25) U?#34.K4(VSS_26) U?#34.K9(VSS_27) U?#34.K11(VSS_28) U?#34.N2(VSS_29) U?#34.N4(VSS_30) U?#34.N9(VSS_31) U?#34.N11(VSS_32) U?#34.P1(VSS_33) U?#34.P3(VSS_34) U?#34.P10(VSS_35) U?#34.P12(VSS_36) U?#34.T1(VSS_37) U?#34.T3(VSS_38) U?#34.T5(VSS_39) U?#34.T8(VSS_40) U?#34.T10(VSS_41) U?#34.T12(VSS_42) U?#34.V1(VSS_43) U?#34.V5(VSS_44) U?#34.V8(VSS_45) U?#34.V12(VSS_46) U?#34.W2(VSS_47) U?#34.W4(VSS_48) U?#34.W9(VSS_49) U?#34.W11(VSS_50) U?#34.Y1(VSS_51) U?#34.Y5(VSS_52) U?#34.Y8(VSS_53) U?#34.Y12(VSS_54) U?#36.A3(VSS_1) U?#36.A10(VSS_2) U?#36.AB3(VSS_55) U?#36.AB5(VSS_56) U?#36.AB8(VSS_57) U?#36.AB10(VSS_58) U?#36.C1(VSS_3) U?#36.C5(VSS_4) U?#36.C8(VSS_5) U?#36.C12(VSS_6) U?#36.D2(VSS_7) U?#36.D4(VSS_8) U?#36.D9(VSS_9) U?#36.D11(VSS_10) U?#36.E1(VSS_11) U?#36.E5(VSS_12) U?#36.E8(VSS_13) U?#36.E12(VSS_14) U?#36.G1(VSS_15) U?#36.G3(VSS_16) U?#36.G5(VSS_17) U?#36.G8(VSS_18) U?#36.G10(VSS_19) U?#36.G12(VSS_20) U?#36.J1(VSS_21) U?#36.J3(VSS_22) U?#36.J10(VSS_23) U?#36.J12(VSS_24) U?#36.K2(VSS_25) U?#36.K4(VSS_26) U?#36.K9(VSS_27) U?#36.K11(VSS_28) U?#36.N2(VSS_29) U?#36.N4(VSS_30) U?#36.N9(VSS_31) U?#36.N11(VSS_32) U?#36.P1(VSS_33) U?#36.P3(VSS_34) U?#36.P10(VSS_35) U?#36.P12(VSS_36) U?#36.T1(VSS_37) U?#36.T3(VSS_38) U?#36.T5(VSS_39) U?#36.T8(VSS_40) U?#36.T10(VSS_41) U?#36.T12(VSS_42) U?#36.V1(VSS_43) U?#36.V5(VSS_44) U?#36.V8(VSS_45) U?#36.V12(VSS_46) U?#36.W2(VSS_47) U?#36.W4(VSS_48) U?#36.W9(VSS_49) U?#36.W11(VSS_50) U?#36.Y1(VSS_51) U?#36.Y5(VSS_52) U?#36.Y8(VSS_53) U?#36.Y12(VSS_54)
VCC1V8_PMU_DDR_S3: C?#200.1 C?#201.1 C?#202.1 C?#203.1 C?#204.1 C?#205.1 C?#206.1 C?#207.1 C?#208.1 C?#244.1 C?#245.1 C?#246.1 C?#247.1 C?#248.1 C?#249.1 C?#250.1 C?#251.1 C?#252.1 U?#34.F1(VDD1_1) U?#34.F12(VDD1_2) U?#34.G4(VDD1_3) U?#34.G9(VDD1_4) U?#34.T4(VDD1_5) U?#34.T9(VDD1_6) U?#34.U1(VDD1_7) U?#34.U12(VDD1_8) U?#36.F1(VDD1_1) U?#36.F12(VDD1_2) U?#36.G4(VDD1_3) U?#36.G9(VDD1_4) U?#36.T4(VDD1_5) U?#36.T9(VDD1_6) U?#36.U1(VDD1_7) U?#36.U12(VDD1_8)
VDD2_DDR_S3: C?#209.1 C?#210.1 C?#211.1 C?#212.1 C?#213.1 C?#214.1 C?#215.1 C?#216.1 C?#217.1 C?#218.1 C?#219.1 C?#220.1 C?#221.1 C?#222.1 C?#223.1 C?#253.1 C?#254.1 C?#255.1 C?#256.1 C?#257.1 C?#258.1 C?#259.1 C?#260.1 C?#261.1 C?#262.1 C?#263.1 C?#264.1 C?#265.1 C?#266.1 C?#267.1 R?#89.1 R?#90.2 R?#95.2 R?#96.2 R?#101.1 R?#102.2 U?#34.A4(VDD2_1) U?#34.A9(VDD2_2) U?#34.AB4(VDD2_23) U?#34.AB9(VDD2_24) U?#34.F5(VDD2_3) U?#34.F8(VDD2_4) U?#34.H1(VDD2_5) U?#34.H5(VDD2_6) U?#34.H8(VDD2_7) U?#34.H12(VDD2_8) U?#34.K1(VDD2_9) U?#34.K3(VDD2_10) U?#34.K10(VDD2_11) U?#34.K12(VDD2_12) U?#34.N1(VDD2_13) U?#34.N3(VDD2_14) U?#34.N10(VDD2_15) U?#34.N12(VDD2_16) U?#34.R1(VDD2_17) U?#34.R5(VDD2_18) U?#34.R8(VDD2_19) U?#34.R12(VDD2_20) U?#34.U5(VDD2_21) U?#34.U8(VDD2_22) U?#36.A4(VDD2_1) U?#36.A9(VDD2_2) U?#36.AB4(VDD2_23) U?#36.AB9(VDD2_24) U?#36.F5(VDD2_3) U?#36.F8(VDD2_4) U?#36.H1(VDD2_5) U?#36.H5(VDD2_6) U?#36.H8(VDD2_7) U?#36.H12(VDD2_8) U?#36.K1(VDD2_9) U?#36.K3(VDD2_10) U?#36.K10(VDD2_11) U?#36.K12(VDD2_12) U?#36.N1(VDD2_13) U?#36.N3(VDD2_14) U?#36.N10(VDD2_15) U?#36.N12(VDD2_16) U?#36.R1(VDD2_17) U?#36.R5(VDD2_18) U?#36.R8(VDD2_19) U?#36.R12(VDD2_20) U?#36.U5(VDD2_21) U?#36.U8(VDD2_22)
VDDQ_DDR: C?#224.1 C?#225.1 C?#226.1 C?#227.1 C?#228.1 C?#229.1 C?#230.1 C?#231.1 C?#232.1 C?#233.1 C?#234.1 C?#235.1 C?#236.1 C?#237.1 C?#238.1 C?#239.1 C?#240.1 C?#241.1 C?#242.1 C?#268.1 C?#269.1 C?#270.1 C?#271.1 C?#272.1 C?#273.1 C?#274.1 C?#275.1 C?#276.1 C?#277.1 C?#278.1 C?#279.1 C?#280.1 C?#281.1 C?#282.1 C?#283.1 C?#284.1 C?#285.1 C?#286.1 R?#91.1 R?#92.1 R?#94.1 R?#95.1 R?#103.1 R?#104.1 U?#34.AA3(VDDQ_17) U?#34.AA5(VDDQ_18) U?#34.AA8(VDDQ_19) U?#34.AA10(VDDQ_20) U?#34.B3(VDDQ_1) U?#34.B5(VDDQ_2) U?#34.B8(VDDQ_3) U?#34.B10(VDDQ_4) U?#34.D1(VDDQ_5) U?#34.D5(VDDQ_6) U?#34.D8(VDDQ_7) U?#34.D12(VDDQ_8) U?#34.F3(VDDQ_9) U?#34.F10(VDDQ_10) U?#34.U3(VDDQ_11) U?#34.U10(VDDQ_12) U?#34.W1(VDDQ_13) U?#34.W5(VDDQ_14) U?#34.W8(VDDQ_15) U?#34.W12(VDDQ_16) U?#36.AA3(VDDQ_17) U?#36.AA5(VDDQ_18) U?#36.AA8(VDDQ_19) U?#36.AA10(VDDQ_20) U?#36.B3(VDDQ_1) U?#36.B5(VDDQ_2) U?#36.B8(VDDQ_3) U?#36.B10(VDDQ_4) U?#36.D1(VDDQ_5) U?#36.D5(VDDQ_6) U?#36.D8(VDDQ_7) U?#36.D12(VDDQ_8) U?#36.F3(VDDQ_9) U?#36.F10(VDDQ_10) U?#36.U3(VDDQ_11) U?#36.U10(VDDQ_12) U?#36.W1(VDDQ_13) U?#36.W5(VDDQ_14) U?#36.W8(VDDQ_15) U?#36.W12(VDDQ_16)
VDDQ_DDR_CK_S0: R?#93.1
VDDQ_DDR_CKE_S3: R?#96.1
VDDQ_DDR_S0: R?#91.2 R?#93.2
DDR_CH0_LP4/4X_CKE0_A: R?#85.2 U?#35.J4(CKE0_a)
DDR_CH0_LP4/4X_CKE0_B: R?#87.2 U?#35.P4(CKE0_b)
DDR_CH0_LP4/4X_CKE1_A: R?#86.2 U?#35.J5(CKE1_a)
DDR_CH0_LP4/4X_CKE1_B: R?#88.2 U?#35.P5(CKE1_b)
DDR_CH1_LP4/4X_CKE0_C: R?#97.2 U?#37.J4(CKE0_a)
DDR_CH1_LP4/4X_CKE0_D: R?#99.2 U?#37.P4(CKE0_b)
DDR_CH1_LP4/4X_CKE1_C: R?#98.2 U?#37.J5(CKE1_a)
DDR_CH1_LP4/4X_CKE1_D: R?#100.2 U?#37.P5(CKE1_b)
DDR_RESET: C?#243.1 C?#287.1 U?#35.T11(RESET_n) U?#37.T11(RESET_n) ; port DDR_RESET
NetR?#85_1: R?#85.1 ; port DDR_CH0_LP4/4X_CKE0/LP5_CS0_A
NetR?#86_1: R?#86.1 ; port DDR_CH0_LP4/4X_CKE1/LP5_CS1_A
NetR?#87_1: R?#87.1 ; port DDR_CH0_LP4/4X_CKE0/LP5_CS0_B
NetR?#88_1: R?#88.1 ; port DDR_CH0_LP4/4X_CKE1/LP5_CS1_B
NetR?#89_2: R?#89.2 U?#35.G2(ODT_CA_a)
NetR?#90_1: R?#90.1 U?#35.T2(ODT_CA_b)
NetR?#92_2: R?#92.2 U?#35.A5(ZQ0)
NetR?#94_2: R?#94.2 U?#35.A8(ZQ1)
NetR?#97_1: R?#97.1 ; port DDR_CH1_LP4/4X_CKE0/LP5_CS0_C
NetR?#98_1: R?#98.1 ; port DDR_CH1_LP4/4X_CKE1/LP5_CS1_C
NetR?#99_1: R?#99.1 ; port DDR_CH1_LP4/4X_CKE0/LP5_CS0_D
NetR?#100_1: R?#100.1 ; port DDR_CH1_LP4/4X_CKE1/LP5_CS1_D
NetR?#101_2: R?#101.2 U?#37.G2(ODT_CA_a)
NetR?#102_1: R?#102.1 U?#37.T2(ODT_CA_b)
NetR?#103_2: R?#103.2 U?#37.A5(ZQ0)
NetR?#104_2: R?#104.2 U?#37.A8(ZQ1)
NetU?#3_AA1: U?#35.C9(DQ14_a) ; port DDR_CH0_DQ14_A
NetU?#3_AA2: U?#35.B9(DQ15_a) ; port DDR_CH0_DQ15_A
NetU?#3_AA4: U?#35.E10(DQS1_c_a) ; port DDR_CH0_DQS1N_A
NetU?#3_AA5: U?#35.D10(DQS1_t_a) ; port DDR_CH0_DQS1P_A
NetU?#3_AB1: U?#35.C11(DQ9_a) ; port DDR_CH0_DQ9_A
NetU?#3_AB2: U?#35.B11(DQ8_a) ; port DDR_CH0_DQ8_A
NetU?#3_AB4: U?#35.C10(DMI1_a) ; port DDR_CH0_DM1_A
NetU?#3_AC1: U?#35.E11(DQ10_a) ; port DDR_CH0_DQ10_A
NetU?#3_AC2: U?#35.F11(DQ11_a) ; port DDR_CH0_DQ11_A
NetU?#3_B1: U?#35.U11(DQ11_b) ; port DDR_CH0_DQ11_B
NetU?#3_C1: U?#35.Y11(DQ9_b) ; port DDR_CH0_DQ9_B
NetU?#3_C2: U?#35.V11(DQ10_b) ; port DDR_CH0_DQ10_B
NetU?#3_D1: U?#35.AA9(DQ15_b) ; port DDR_CH0_DQ15_B
NetU?#3_D2: U?#35.AA11(DQ8_b) ; port DDR_CH0_DQ8_B
NetU?#3_E1: U?#35.V9(DQ13_b) ; port DDR_CH0_DQ13_B
NetU?#3_E2: U?#35.Y9(DQ14_b) ; port DDR_CH0_DQ14_B
NetU?#3_E4: U?#35.Y10(DMI1_b) ; port DDR_CH0_DM1_B
NetU?#3_F1: U?#35.U4(DQ4_b) ; port DDR_CH0_DQ4_B
NetU?#3_F2: U?#35.U9(DQ12_b) ; port DDR_CH0_DQ12_B
NetU?#3_F4: U?#35.V10(DQS1_c_b) ; port DDR_CH0_DQS1N_B
NetU?#3_F5: U?#35.W10(DQS1_t_b) ; port DDR_CH0_DQS1P_B
NetU?#3_G1: U?#35.Y4(DQ6_b) ; port DDR_CH0_DQ6_B
NetU?#3_G2: U?#35.V4(DQ5_b) ; port DDR_CH0_DQ5_B
NetU?#3_G4: U?#35.Y3(DMI0_b) ; port DDR_CH0_DM0_B
NetU?#3_H1: U?#35.AA2(DQ0_b) ; port DDR_CH0_DQ0_B
NetU?#3_H2: U?#35.AA4(DQ7_b) ; port DDR_CH0_DQ7_B
NetU?#3_J1: U?#35.V2(DQ2_b) ; port DDR_CH0_DQ2_B
NetU?#3_J2: U?#35.Y2(DQ1_b) ; port DDR_CH0_DQ1_B
NetU?#3_J7: U?#35.V3(DQS0_c_b) ; port DDR_CH0_DQS0N_B
NetU?#3_J8: U?#35.W3(DQS0_t_b) ; port DDR_CH0_DQS0P_B
NetU?#3_K1: U?#35.R11(CA4_b) ; port DDR_CH0_A4_B
NetU?#3_K2: U?#35.U2(DQ3_b) ; port DDR_CH0_DQ3_B
NetU?#3_L2: U?#35.P11(CA5_B) ; port DDR_CH0_A5_B
NetU?#3_L7: U?#35.R4(CS0_b) ; port DDR_CH0_LP4/4X_CS0_B
NetU?#3_L8: U?#35.R3(CS1_b) ; port DDR_CH0_LP4/4X_CS1_B
NetU?#3_M1: U?#35.P9(CK_c_b) ; port DDR_CH0_CLKN_B
NetU?#3_M2: U?#35.P8(CK_t_b) ; port DDR_CH0_CLKP_B
NetU?#3_M5: U?#35.P2(CA1_b) ; port DDR_CH0_A1_B
NetU?#3_M8: U?#35.R2(CA0_b) ; port DDR_CH0_A0_B
NetU?#3_N1: U?#35.J9(CK_c_a) ; port DDR_CH0_CLKN_A
NetU?#3_N2: U?#35.J8(CK_t_a) ; port DDR_CH0_CLKP_A
NetU?#3_N4: U?#35.R10(CA3_b) ; port DDR_CH0_A3_B
NetU?#3_N5: U?#35.R9(CA2_b) ; port DDR_CH0_A2_B
NetU?#3_P2: U?#35.J11(CA5_a) ; port DDR_CH0_A5_A
NetU?#3_P4: U?#35.H9(CA2_a) ; port DDR_CH0_A2_A
NetU?#3_P5: U?#35.H10(CA3_a) ; port DDR_CH0_A3_A
NetU?#3_R1: U?#35.H11(CA4_a) ; port DDR_CH0_A4_A
NetU?#3_R2: U?#35.F2(DQ3_a) ; port DDR_CH0_DQ3_A
NetU?#3_R6: U?#35.H4(CS0_a) ; port DDR_CH0_LP4/4X_CS0_A
NetU?#3_R7: U?#35.H3(CS1_a) ; port DDR_CH0_LP4/4X_CS1_A
NetU?#3_T1: U?#35.E2(DQ2_a) ; port DDR_CH0_DQ2_A
NetU?#3_T2: U?#35.C2(DQ1_a) ; port DDR_CH0_DQ1_A
NetU?#3_T7: U?#35.H2(CA0_a) ; port DDR_CH0_A0_A
NetU?#3_T8: U?#35.J2(CA1_a) ; port DDR_CH0_A1_A
NetU?#3_U1: U?#35.B2(DQ0_a) ; port DDR_CH0_DQ0_A
NetU?#3_U2: U?#35.B4(DQ7_a) ; port DDR_CH0_DQ7_A
NetU?#3_U4: U?#35.E3(DQS0_c_a) ; port DDR_CH0_DQS0N_A
NetU?#3_U5: U?#35.D3(DQS0_t_a) ; port DDR_CH0_DQS0P_A
NetU?#3_V1: U?#35.C4(DQ6_a) ; port DDR_CH0_DQ6_A
NetU?#3_V2: U?#35.E4(DQ5_a) ; port DDR_CH0_DQ5_A
NetU?#3_W1: U?#35.F4(DQ4_a) ; port DDR_CH0_DQ4_A
NetU?#3_Y1: U?#35.F9(DQ12_a) ; port DDR_CH0_DQ12_A
NetU?#3_Y2: U?#35.E9(DQ13_a) ; port DDR_CH0_DQ13_A
NetU?#3_Y4: U?#35.C3(DMI0_a) ; port DDR_CH0_DM0_A
NetU?#4_A2: U?#37.E11(DQ10_a) ; port DDR_CH1_DQ10_C
NetU?#4_A3: U?#37.B11(DQ8_a) ; port DDR_CH1_DQ8_C
NetU?#4_A4: U?#37.C9(DQ14_a) ; port DDR_CH1_DQ14_C
NetU?#4_A5: U?#37.F9(DQ12_a) ; port DDR_CH1_DQ12_C
NetU?#4_A6: U?#37.F4(DQ4_a) ; port DDR_CH1_DQ4_C
NetU?#4_A7: U?#37.C4(DQ6_a) ; port DDR_CH1_DQ6_C
NetU?#4_A8: U?#37.B2(DQ0_a) ; port DDR_CH1_DQ0_C
NetU?#4_A9: U?#37.E2(DQ2_a) ; port DDR_CH1_DQ2_C
NetU?#4_A10: U?#37.H11(CA4_a) ; port DDR_CH1_A4_C
NetU?#4_A12: U?#37.J9(CK_c_a) ; port DDR_CH1_CLKN_C
NetU?#4_A13: U?#37.P9(CK_c_b) ; port DDR_CH1_CLKN_D
NetU?#4_A15: U?#37.R11(CA4_b) ; port DDR_CH1_A4_D
NetU?#4_A16: U?#37.V2(DQ2_b) ; port DDR_CH1_DQ2_D
NetU?#4_A17: U?#37.AA2(DQ0_b) ; port DDR_CH1_DQ0_D
NetU?#4_A18: U?#37.Y4(DQ6_b) ; port DDR_CH1_DQ6_D
NetU?#4_A19: U?#37.U4(DQ4_b) ; port DDR_CH1_DQ4_D
NetU?#4_A20: U?#37.U9(DQ12_b) ; port DDR_CH1_DQ12_D
NetU?#4_A21: U?#37.Y9(DQ14_b) ; port DDR_CH1_DQ14_D
NetU?#4_A22: U?#37.AA11(DQ8_b) ; port DDR_CH1_DQ8_D
NetU?#4_A23: U?#37.V11(DQ10_b) ; port DDR_CH1_DQ10_D
NetU?#4_B2: U?#37.F11(DQ11_a) ; port DDR_CH1_DQ11_C
NetU?#4_B3: U?#37.C11(DQ9_a) ; port DDR_CH1_DQ9_C
NetU?#4_B4: U?#37.B9(DQ15_a) ; port DDR_CH1_DQ15_C
NetU?#4_B5: U?#37.E9(DQ13_a) ; port DDR_CH1_DQ13_C
NetU?#4_B7: U?#37.E4(DQ5_a) ; port DDR_CH1_DQ5_C
NetU?#4_B8: U?#37.B4(DQ7_a) ; port DDR_CH1_DQ7_C
NetU?#4_B9: U?#37.C2(DQ1_a) ; port DDR_CH1_DQ1_C
NetU?#4_B10: U?#37.F2(DQ3_a) ; port DDR_CH1_DQ3_C
NetU?#4_B11: U?#37.J11(CA5_a) ; port DDR_CH1_A5_C
NetU?#4_B12: U?#37.J8(CK_t_a) ; port DDR_CH1_CLKP_C
NetU?#4_B13: U?#37.P8(CK_t_b) ; port DDR_CH1_CLKP_D
NetU?#4_B14: U?#37.P11(CA5_B) ; port DDR_CH1_A5_D
NetU?#4_B15: U?#37.U2(DQ3_b) ; port DDR_CH1_DQ3_D
NetU?#4_B16: U?#37.Y2(DQ1_b) ; port DDR_CH1_DQ1_D
NetU?#4_B17: U?#37.AA4(DQ7_b) ; port DDR_CH1_DQ7_D
NetU?#4_B18: U?#37.V4(DQ5_b) ; port DDR_CH1_DQ5_D
NetU?#4_B20: U?#37.V9(DQ13_b) ; port DDR_CH1_DQ13_D
NetU?#4_B21: U?#37.AA9(DQ15_b) ; port DDR_CH1_DQ15_D
NetU?#4_B22: U?#37.Y11(DQ9_b) ; port DDR_CH1_DQ9_D
NetU?#4_B23: U?#37.U11(DQ11_b) ; port DDR_CH1_DQ11_D
NetU?#4_D4: U?#37.C10(DMI1_a) ; port DDR_CH1_DM1_C
NetU?#4_D5: U?#37.E10(DQS1_c_a) ; port DDR_CH1_DQS1N_C
NetU?#4_D9: U?#37.E3(DQS0_c_a) ; port DDR_CH1_DQS0N_C
NetU?#4_D13: U?#37.H10(CA3_a) ; port DDR_CH1_A3_C
NetU?#4_D19: U?#37.R3(CS1_b) ; port DDR_CH1_LP4/4X_CS1_D
NetU?#4_D20: U?#37.Y3(DMI0_b) ; port DDR_CH1_DM0_D
NetU?#4_D21: U?#37.W10(DQS1_t_b) ; port DDR_CH1_DQS1P_D
NetU?#4_D22: U?#37.Y10(DMI1_b) ; port DDR_CH1_DM1_D
NetU?#4_E5: U?#37.D10(DQS1_t_a) ; port DDR_CH1_DQS1P_C
NetU?#4_E9: U?#37.D3(DQS0_t_a) ; port DDR_CH1_DQS0P_C
NetU?#4_E13: U?#37.H9(CA2_a) ; port DDR_CH1_A2_C
NetU?#4_E14: U?#37.R10(CA3_b) ; port DDR_CH1_A3_D
NetU?#4_E19: U?#37.R4(CS0_b) ; port DDR_CH1_LP4/4X_CS0_D
NetU?#4_E21: U?#37.V10(DQS1_c_b) ; port DDR_CH1_DQS1N_D
NetU?#4_F8: U?#37.C3(DMI0_a) ; port DDR_CH1_DM0_C
NetU?#4_F12: U?#37.J2(CA1_a) ; port DDR_CH1_A1_C
NetU?#4_G11: U?#37.H4(CS0_a) ; port DDR_CH1_LP4/4X_CS0_C
NetU?#4_G12: U?#37.H2(CA0_a) ; port DDR_CH1_A0_C
NetU?#4_G13: U?#37.R9(CA2_b) ; port DDR_CH1_A2_D
NetU?#4_G14: U?#37.P2(CA1_b) ; port DDR_CH1_A1_D
NetU?#4_G16: U?#37.V3(DQS0_c_b) ; port DDR_CH1_DQS0N_D
NetU?#4_H11: U?#37.H3(CS1_a) ; port DDR_CH1_LP4/4X_CS1_C
NetU?#4_H15: U?#37.R2(CA0_b) ; port DDR_CH1_A0_D
NetU?#4_H16: U?#37.W3(DQS0_t_b) ; port DDR_CH1_DQS0P_D

Not connected (* = marked no-connect by the designer): U?#34 A1(DNU_1)* A2(DNU_2)* A11(DNU_3)* A12(DNU_4)* AA1(DNU_7)* AA12(DNU_8)* AB1(DNU_9)* AB2(DNU_10)* AB11(DNU_11)* AB12(DNU_12)* B1(DNU_5)* B12(DNU_6)*; U?#35 G11(ZQ2_NC)* K5(CS2_a_NC)* K8(CKE2_a_NC)* N5(CS2_b_NC)* N8(CKE2_b_NC)*; U?#36 A1(DNU_1)* A2(DNU_2)* A11(DNU_3)* A12(DNU_4)* AA1(DNU_7)* AA12(DNU_8)* AB1(DNU_9)* AB2(DNU_10)* AB11(DNU_11)* AB12(DNU_12)* B1(DNU_5)* B12(DNU_6)*; U?#37 G11(ZQ2_NC)* K5(CS2_a_NC)* K8(CKE2_a_NC)* N5(CS2_b_NC)* N8(CKE2_b_NC)*

### Notes on the sheet
- LPDDR4/4X
- 0.6V
- LPDDR4
- DNP
- (near R?#95) 0R
- 1.1V
- LPDDR4x
- 0R
- Sequence:VDD1-VDD2-VDDQ
- LPDDR4    LPDDR4X
  VDD1:  1.70-1.95  1.70-1.95
  VDD2:  1.06-1.17  1.06-1.17
  VDDQ:  1.06-1.17  0.57-0.65
- 420x594
- Формат А2
- (in symbol LPDDR4_200P, part A) CH A; CH B
- (in symbol LPDDR4_200P, part B) VDD1: 1.8V; LPDDR4  LPDDR4X; VDD2: 1.1V    1.1V; VDDQ: 1.1V    0.6V